# Altium project EFR32xG27_BLE_AGR_REF_DES_A00.PrjPCB
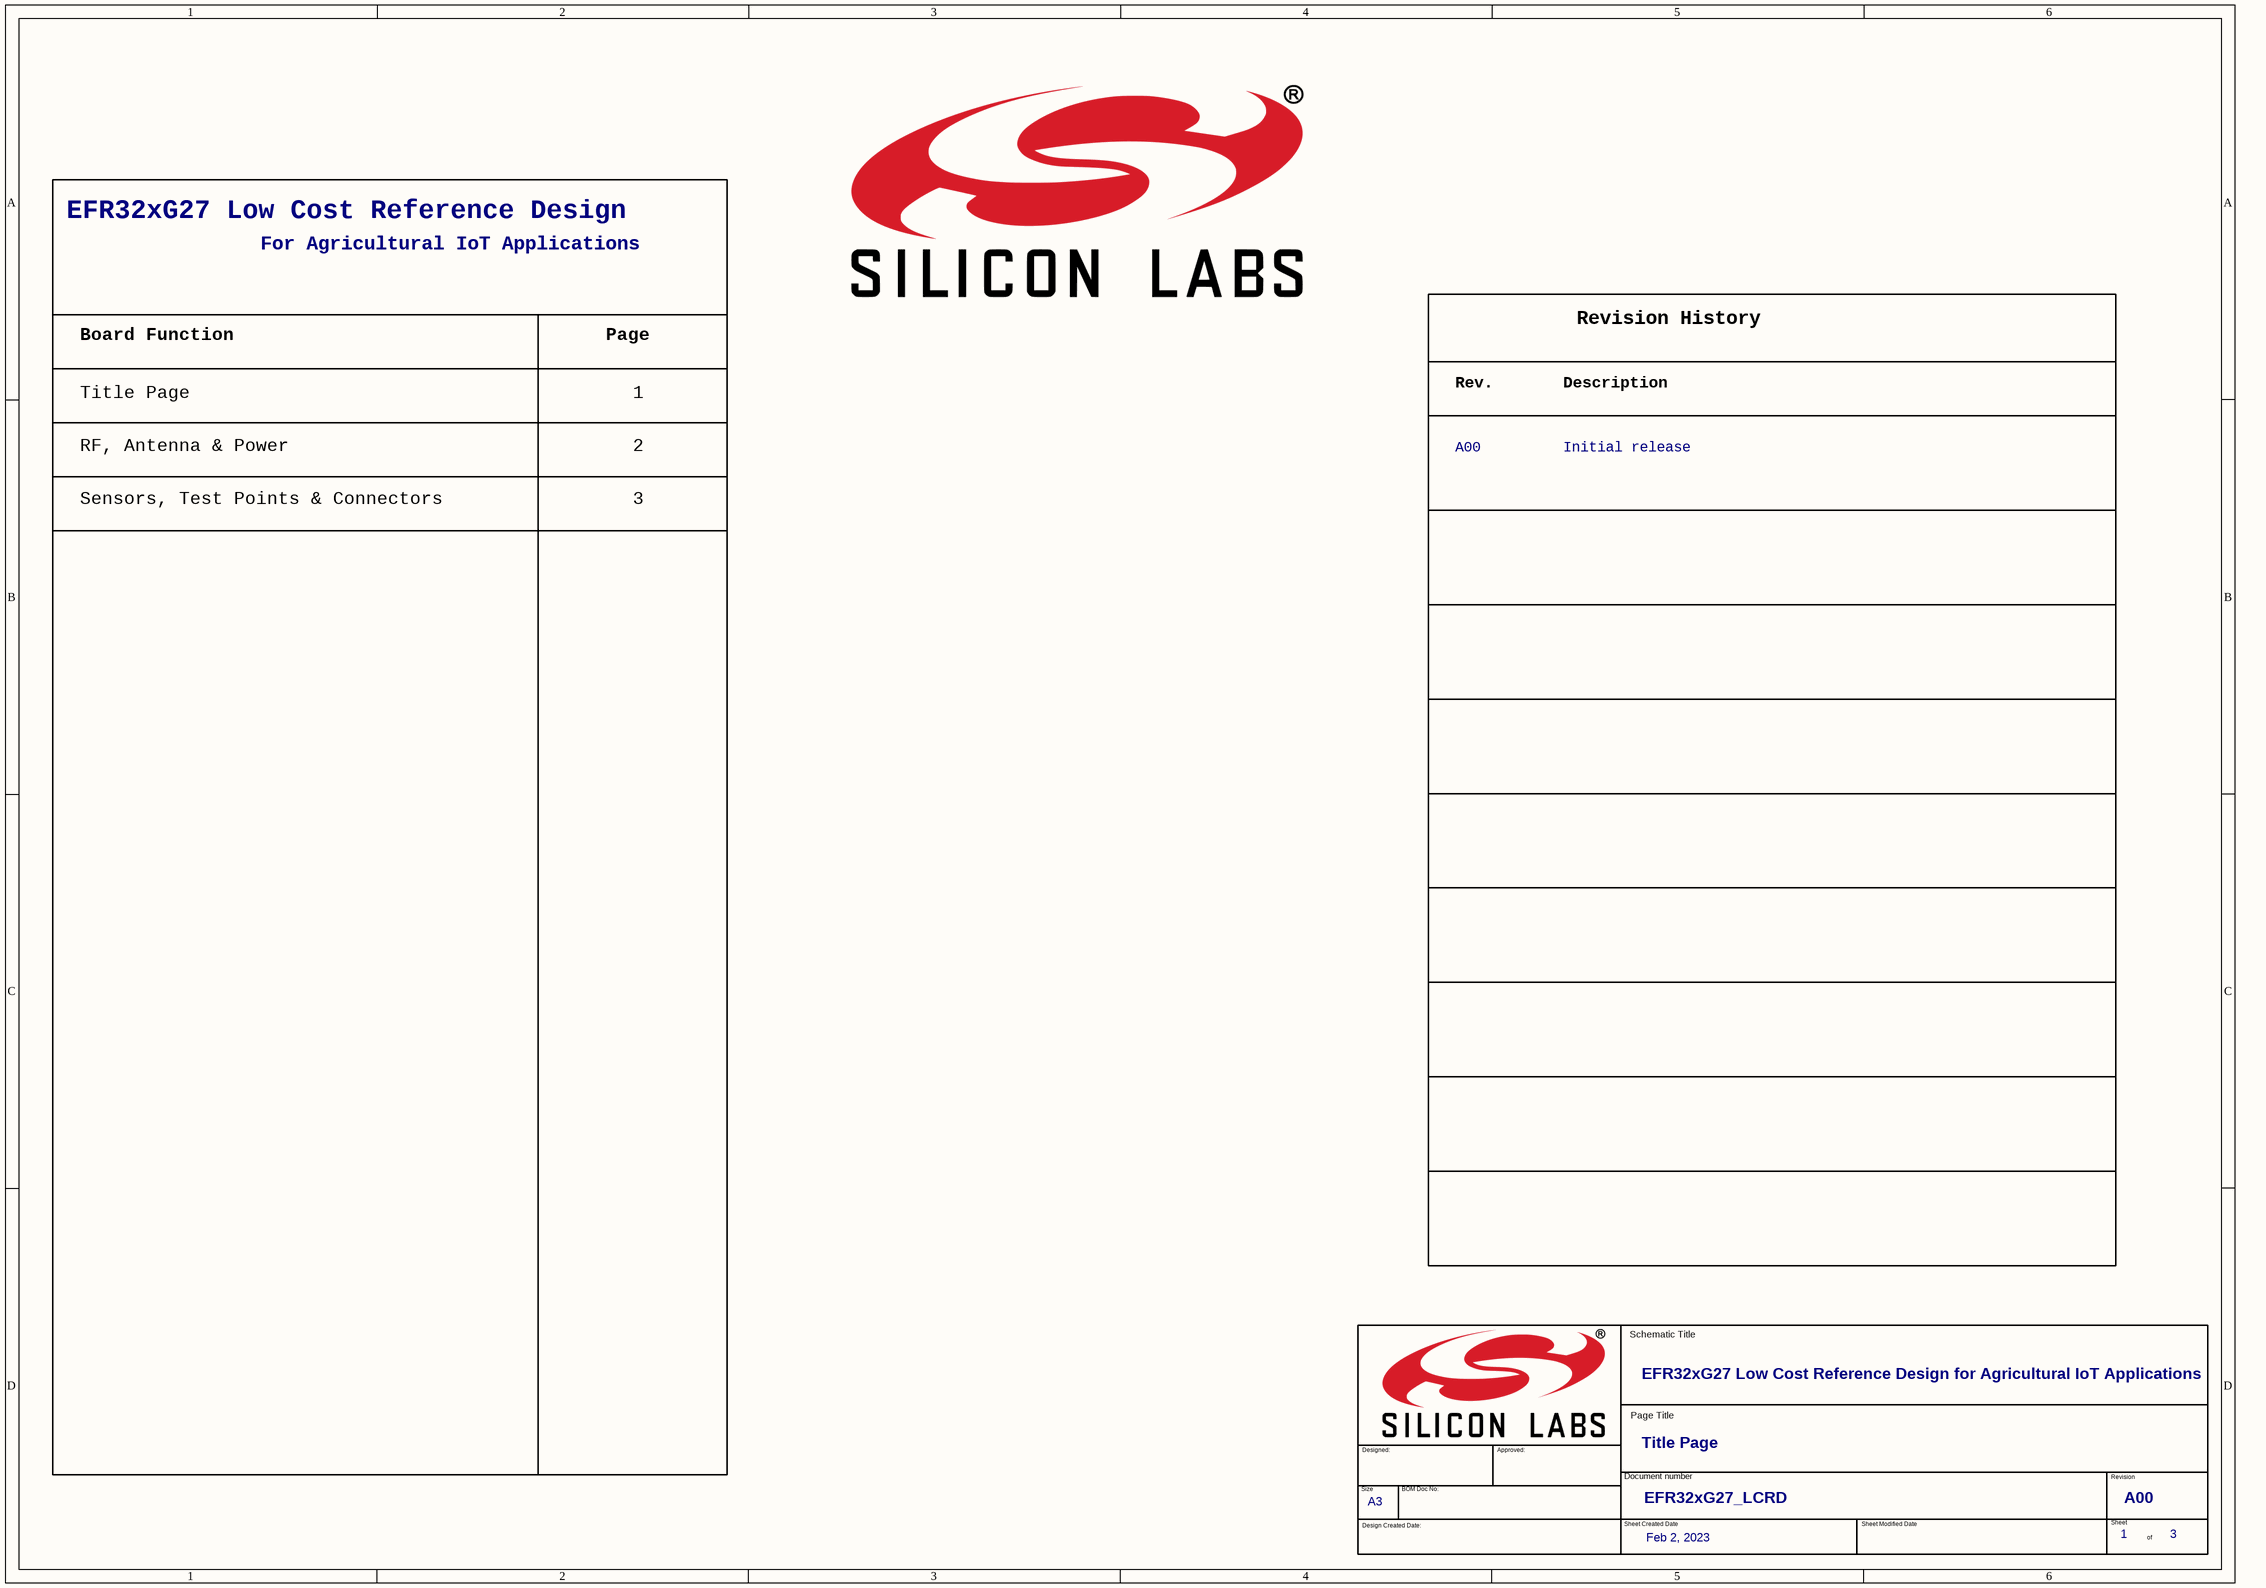
[diagram p0: EFR32xG27_BLE_AGR_REF_DES_A00_Cover.SchDoc]
AssemblyPrintName: EFR32xG22_LC_REF_DES_A02_ASM; Board_No: EFR32xG22_LCRD; Board_Rev: A02; CamPrintName: EFR32xG22_LC_REF_DES_A01_CAM; ClassName: PCB Only; Company_Address_1: 343 Congress St; Company_Address_2: 4th Floor; Company_Address_3: Boston, MA 02210; Company_Design_Group: IoT Wireless Hardware Applications; Company_Tel: 617-951-0200; Company_Web_Site: www.silabs.com; FabPrintName: EFR32xG22_LC_REF_DES_A01_FAB; PCBLayoutName: EFR32xG22_LC_REF_DES_A01; SchematicName: EFR32xG22_LC_REF_DES_A02_SCH; Title: EFR32xG22 Low Cost Reference Design; VariantName: EFR32xG22_LC_REF_DES_A01; XYReportName: EFR32xG22_LC_REF_DES_A02_XYR
3 sheets, 119 parts. Net scope: global (net labels, ports and power ports of the same name join across sheets).
Board file: EFR32xG27_BLE_AGR_REF_DES_A00.PcbDoc
Sheets:
  EFR32xG27_BLE_AGR_REF_DES_A00_Cover.SchDoc
  EFR32xG27_BLE_AGR_REF_DES_A00_Sheet1.SchDoc
  EFR32xG27_BLE_AGR_REF_DES_A00_Sheet2.SchDoc

## Sheet EFR32xG27_BLE_AGR_REF_DES_A00_Cover.SchDoc: EFR32xG22 Low Cost Reference Design
size 420 x 297 mm

### Parts
(Parts that share a designator on the sheet are numbered #1, #2 ... from top to bottom, then left to right.)
*?#1  Header A: EFR32xG27 Low Cost Reference Design  (hidden comment: Toc_Header)  (graphical)
*?#2  Rev1: A00  (hidden comment: Rev_History)  (graphical)
*?#3  Page Title: Title Page  Page Size: A3  Title: EFR32xG27 Low Cost Reference Design for Agricultural IoT Applications  Page Number: 1  Page Count: 3  (hidden comment: TitleBlock_EnergyMicro_A3)  (graphical)

### Notes on the sheet
- For Agricultural IoT Applications
- Board Function
- Page
- RF, Antenna & Power
- Title Page
- 1
- 2
- Initial release
- Sensors, Test Points & Connectors
- 3
- EFR32xG27_LCRD
- Feb 2, 2023
- A00
- (in symbol Rev_History) Revision History; Rev.; Description
- (in symbol TitleBlock_EnergyMicro_A3) Schematic Title; Page Title; Designed:; Approved:; Document number; Revision; Size; BOM Doc No:; Design Created Date:; Sheet Created Date; Sheet Modified Date; Sheet; of

### Library data of the parts
*?#1 = Toc_Header: Title: EFR32xG21 2.4 GHz 20 dBm Radio Board; RevCode: A00; OrgName: Silicon Labs; Page Number: 1; Page Count: 4; Doc: BRD4180A
*?#2 = Rev_History: Initial release; Doc: BRD4180A; Title: EFR32xG21 2.4 GHz 20 dBm Radio Board; OrgAddr2: JNO; OrgAddr1: JSH; OrgName: Silicon Labs; Page Number: 1; Page Count: 5; RevCode: A00
*?#3 = TitleBlock_EnergyMicro_A3: OrgName: Silicon Labs

## Sheet EFR32xG27_BLE_AGR_REF_DES_A00_Sheet1.SchDoc: EFR32xG22 Low Cost Reference Design
size 420 x 297 mm
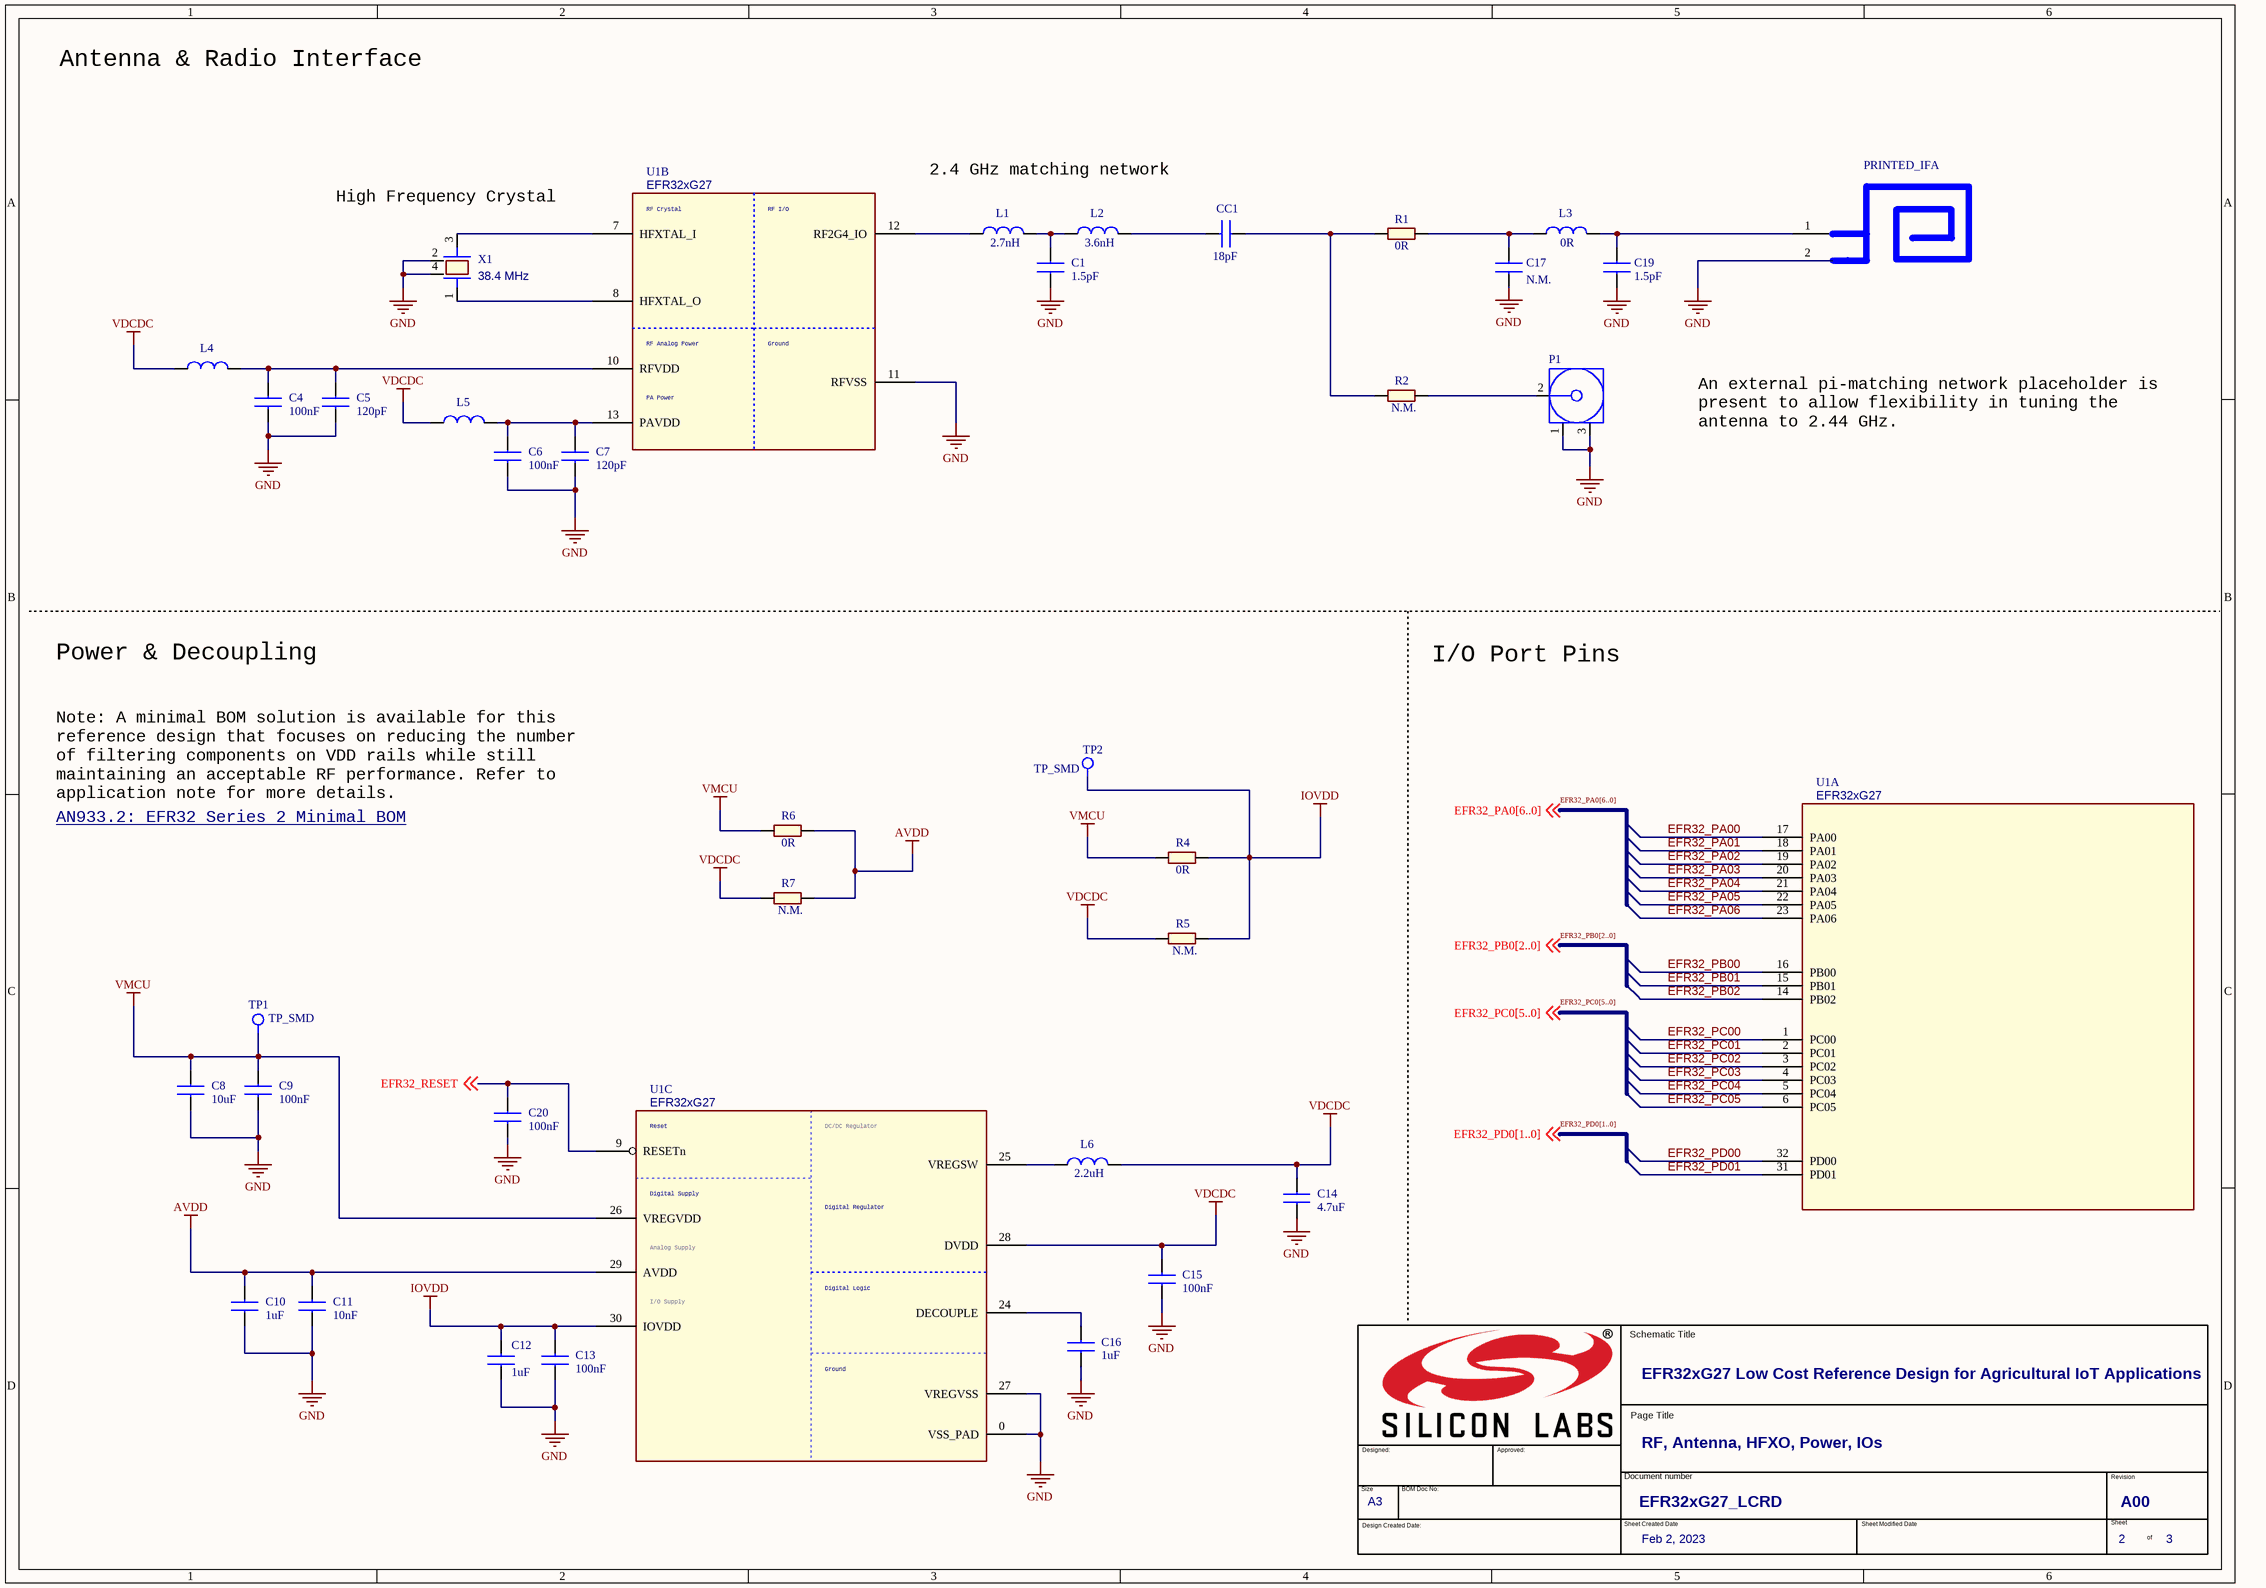
[diagram p1: EFR32xG27_BLE_AGR_REF_DES_A00_Sheet1.SchDoc]

### Parts
(Parts that share a designator on the sheet are numbered #1, #2 ... from top to bottom, then left to right.)
*?#4  Page Title: RF, Antenna, HFXO, Power, IOs  Page Size: A3  Title: EFR32xG27 Low Cost Reference Design for Agricultural IoT Applications  Page Number: 2  Page Count: 3  (hidden comment: TitleBlock_EnergyMicro_A3)  (graphical)
AT1  PRINTED_IFA  [SPIRAL_IFA_INV]
C1  value 1.5pF  [0201]
C4  value 100nF  [0201]
C5  value 120pF  [0201]
C6  value 100nF  [0201]
C7  value 120pF  [0201]
C8  value 10uF  [C_0402]
C9  value 100nF  [0201]
C10  value 1uF  [C_0402]
C11  value 10nF  [0201]
C12  value 1uF  [C_0402]
C13  value 100nF  [0201]
C14  value 4.7uF  [C_0402]
C15  value 100nF  [0201]
C16  value 1uF  [C_0402]
C17  Not Mounted: N.M.  [0201]
C19  value 1.5pF  [0201]
C20  value 100nF  [0201]
CC1  value 18pF  [0201]
L1  value 2.7nH  [0201]
L2  value 3.6nH  [0201]
L3  value 0R  [0201]
L4  (no value)  [L_0603]
L5  (no value)  [L_0603]
L6  value 2.2uH  [L_0603]
P1  1909763-1  [TECO-1909763-1_V]  (value not drawn)
R1  value 0R  [0201]
R2  Not Mounted: N.M.  [0201]
R4  value 0R  [0201]
R5  Not Mounted: N.M.  [0201]
R6  value 0R  [0201]
R7  Not Mounted: N.M.  [0201]
TP1  TP_SMD  [TP]
TP2  TP_SMD  [TP]
U1  EFR32xG27  [EFR_QFN32]  (parts A,B,C of 3)
X1  38.4 MHz  [HFXO_TZ2205E]

### Nets
AVDD: C10.1 C11.1 R6.2 R7.2 U1.29(AVDD)
GND: AT1.2(GND) C1.2 C4.2 C5.2 C6.2 C7.2 C8.2 C9.2 C10.2 C11.2 C12.2 C13.2 C14.2 C15.2 C16.2 C17.2 C19.2 C20.2 P1.1 P1.3 U1.0(VSS_PAD) U1.11(RFVSS) U1.27(VREGVSS) X1.2 X1.4
IOVDD: C12.1 C13.1 R4.2 R5.2 TP2.1(TP) U1.30(IOVDD)
VDCDC: C14.1 C15.1 L4.1 L5.1 L6.2 R5.1 R7.1 U1.28(DVDD)
VMCU: C8.1 C9.1 R4.1 R6.1 TP1.1(TP) U1.26(VREGVDD)
EFR32_PA00: U1.17(PA00)
EFR32_PA01: U1.18(PA01)
EFR32_PA02: U1.19(PA02)
EFR32_PA03: U1.20(PA03)
EFR32_PA04: U1.21(PA04)
EFR32_PA05: U1.22(PA05)
EFR32_PA06: U1.23(PA06)
EFR32_PB00: U1.16(PB00)
EFR32_PB01: U1.15(PB01)
EFR32_PB02: U1.14(PB02)
EFR32_PC00: U1.1(PC00)
EFR32_PC01: U1.2(PC01)
EFR32_PC02: U1.3(PC02)
EFR32_PC03: U1.4(PC03)
EFR32_PC04: U1.5(PC04)
EFR32_PC05: U1.6(PC05)
EFR32_PD00: U1.32(PD00)
EFR32_PD01: U1.31(PD01)
EFR32_RESET: C20.1 U1.9(RESETn) ; off-sheet EFR32_RESET
NetC1_1: C1.1 L1.2 L2.1
NetC4_1: C4.1 C5.1 L4.2 U1.10(RFVDD)
NetC6_1: C6.1 C7.1 L5.2 U1.13(PAVDD)
NetC16_1: C16.1 U1.24(DECOUPLE)
NetC17_1: C17.1 L3.1 R1.2
NetC19_1: C19.1 L3.2
NetCC1_1: CC1.1 L2.2
NetCC1_2: CC1.2 R1.1 R2.1
NetL1_1: L1.1 U1.12(RF2G4_IO)
NetL6_1: L6.1 U1.25(VREGSW)
NetP1_2: P1.2 R2.2
NetU1_7: U1.7(HFXTAL_I) X1.3
NetU1_8: U1.8(HFXTAL_O) X1.1

Not connected (* = marked no-connect by the designer): AT1 1(RF)

### Buses and harness runs
bus EFR32_PA0[6..0]
bus EFR32_PB0[2..0]
bus EFR32_PC0[5..0]
bus EFR32_PD0[1..0]

### Notes on the sheet
- Antenna & Radio Interface
- 2.4 GHz matching network
- (near X1) High Frequency Crystal
- An external pi-matching network placeholder is present to allow flexibility in tuning the antenna to 2.44 GHz.
- Power & Decoupling
- I/O Port Pins
- Note: A minimal BOM solution is available for this reference design that focuses on reducing the number of filtering components on VDD rails while still maintaining an acceptable RF performance. Refer to application note for more details.
- AN933.2: EFR32 Series 2 Minimal BOM
- Feb 2, 2023
- EFR32xG27_LCRD
- A00
- Labels drawn without touching a wire or pin: EFR32_PA0[6..0], EFR32_PB0[2..0], EFR32_PC0[5..0], EFR32_PD0[1..0]
- (in symbol EFR32xG22-2.4GHZ-QFN32, part B) RF Crystal; RF I/O; RF Analog Power; Ground; PA Power
- (in symbol EFR32xG22-2.4GHZ-QFN32, part C) Reset; DC/DC Regulator; Digital Supply; Digital Regulator; Analog Supply; Digital Logic; I/O Supply; Ground
- (in symbol TitleBlock_EnergyMicro_A3) Schematic Title; Page Title; Designed:; Approved:; Document number; Revision; Size; BOM Doc No:; Design Created Date:; Sheet Created Date; Sheet Modified Date; Sheet; of

### Library data of the parts
*?#4 = TitleBlock_EnergyMicro_A3: OrgName: Silicon Labs
AT1 = SPIRAL_IFA
C1 C19 = C0201: Ceramic capacitor; Manufacturer: Murata; Part Number: GRM0335C1H1R5BA01; Rating: 50V; Tolerance: 0.1pF; Technology: C0G; Package: SMD0201
C4 C6 C9 C13 C15 C20 = C0201: Ceramic capacitor; Manufacturer: Murata; Part Number: GRM033R61E104ME14; Rating: 25V; Tolerance: 20%; Technology: X5R; Package: SMD0201
C5 C7 = C0201: Ceramic capacitor; Manufacturer: Murata; Part Number: GRM0335C1H121JA01; Rating: 50V; Tolerance: 5%; Technology: C0G; Package: SMD0201
C8 = C0201: Ceramic capacitor; Manufacturer: Murata; Part Number: GRM155R61C105MA12; Rating: 6.3V; Tolerance: 20%; Technology: X5R; Package: SMD0402
C10 C12 C16 = C0201: Ceramic capacitor; Manufacturer: Murata; Part Number: GRM155R61C105MA12; Rating: 16V; Tolerance: 20%; Technology: X5R; Package: SMD0402
C11 = C0201: Ceramic capacitor; Manufacturer: Murata; Part Number: GRM033R61A103MA01; Rating: 10V; Tolerance: 20%; Technology: X5R; Package: SMD0201
C14 = C0201: Ceramic capacitor; Manufacturer: Murata; Part Number: GRM155R61C105MA12; Rating: 10V; Tolerance: 20%; Technology: X6T; Package: SMD0402
C17 = C0201: Ceramic capacitor; Manufacturer: Murata; Part Number: GRM0335C1H1R6BA01; Rating: 50V; Tolerance: 0.1pF; Technology: C0G; Package: SMD0201
CC1 = C0201: Ceramic capacitor; Manufacturer: Murata; Part Number: GRM0335C1H180JA01; Rating: 50V; Tolerance: 5%; Technology: C0G; Package: SMD0201
L1 = L0201: Chip Inductor; Part Number: LQP03TN2N7B02; Manufacturer: Murata; Tolerance: 0.1nH; Rating: 500mA; Package: SMD0201
L2 = L0201: Chip Inductor; Part Number: LQP03TN3N6B02; Manufacturer: Murata; Tolerance: 0.1nH; Rating: 400mA; Package: SMD0201
L3 = L0201: Chip Inductor; Part Number: LQP03TN5N1H02; Manufacturer: Murata; Tolerance: 3%; Rating: 350mA; Package: SMD0201
L4 L5 = L0201: Ferrite Bead; Part Number: BLM18AG102SN1; Manufacturer: Murata; Value: 1000R; Rating: 450mA; DCR: 0.5R; Package: SMD0603
L6 = L0201: Ferrite Bead; Part Number: LQM18PZ2R2MFH; Manufacturer: Murata; Tolerance: 20%; Rating: 300mA; Package: SMD0603
P1 = CN-1P-M-RF3: SMT Ultra Miniature Coaxial Connector 50-ohm Jack, Female; Manufacturer: TE Connectivity; Package: TECO-1909763-1, 2.6 x 2.6 mm
R1 R4 R6 = R0201: zero ohm resistor; Manufacturer: Any
R2 R5 R7 = R0201: zero ohm resistor; Manufacturer: Any; Value: 0R
U1 = EFR32xG22-2.4GHZ-QFN32: 32-pin Wireless MCU, EFR32xG27 with buck converter; Manufacturer: Silicon Labs; Package: QFN32
X1 = HFXO: 38.4 MHz high frequency crystal; Part Number: TZ3398B; Manufacturer: Tai-Saw Technology; Tolerance: 20ppm; Load capacitance: 10pF

## Sheet EFR32xG27_BLE_AGR_REF_DES_A00_Sheet2.SchDoc: EFR32xG22 Low Cost Reference Design
size 420 x 297 mm
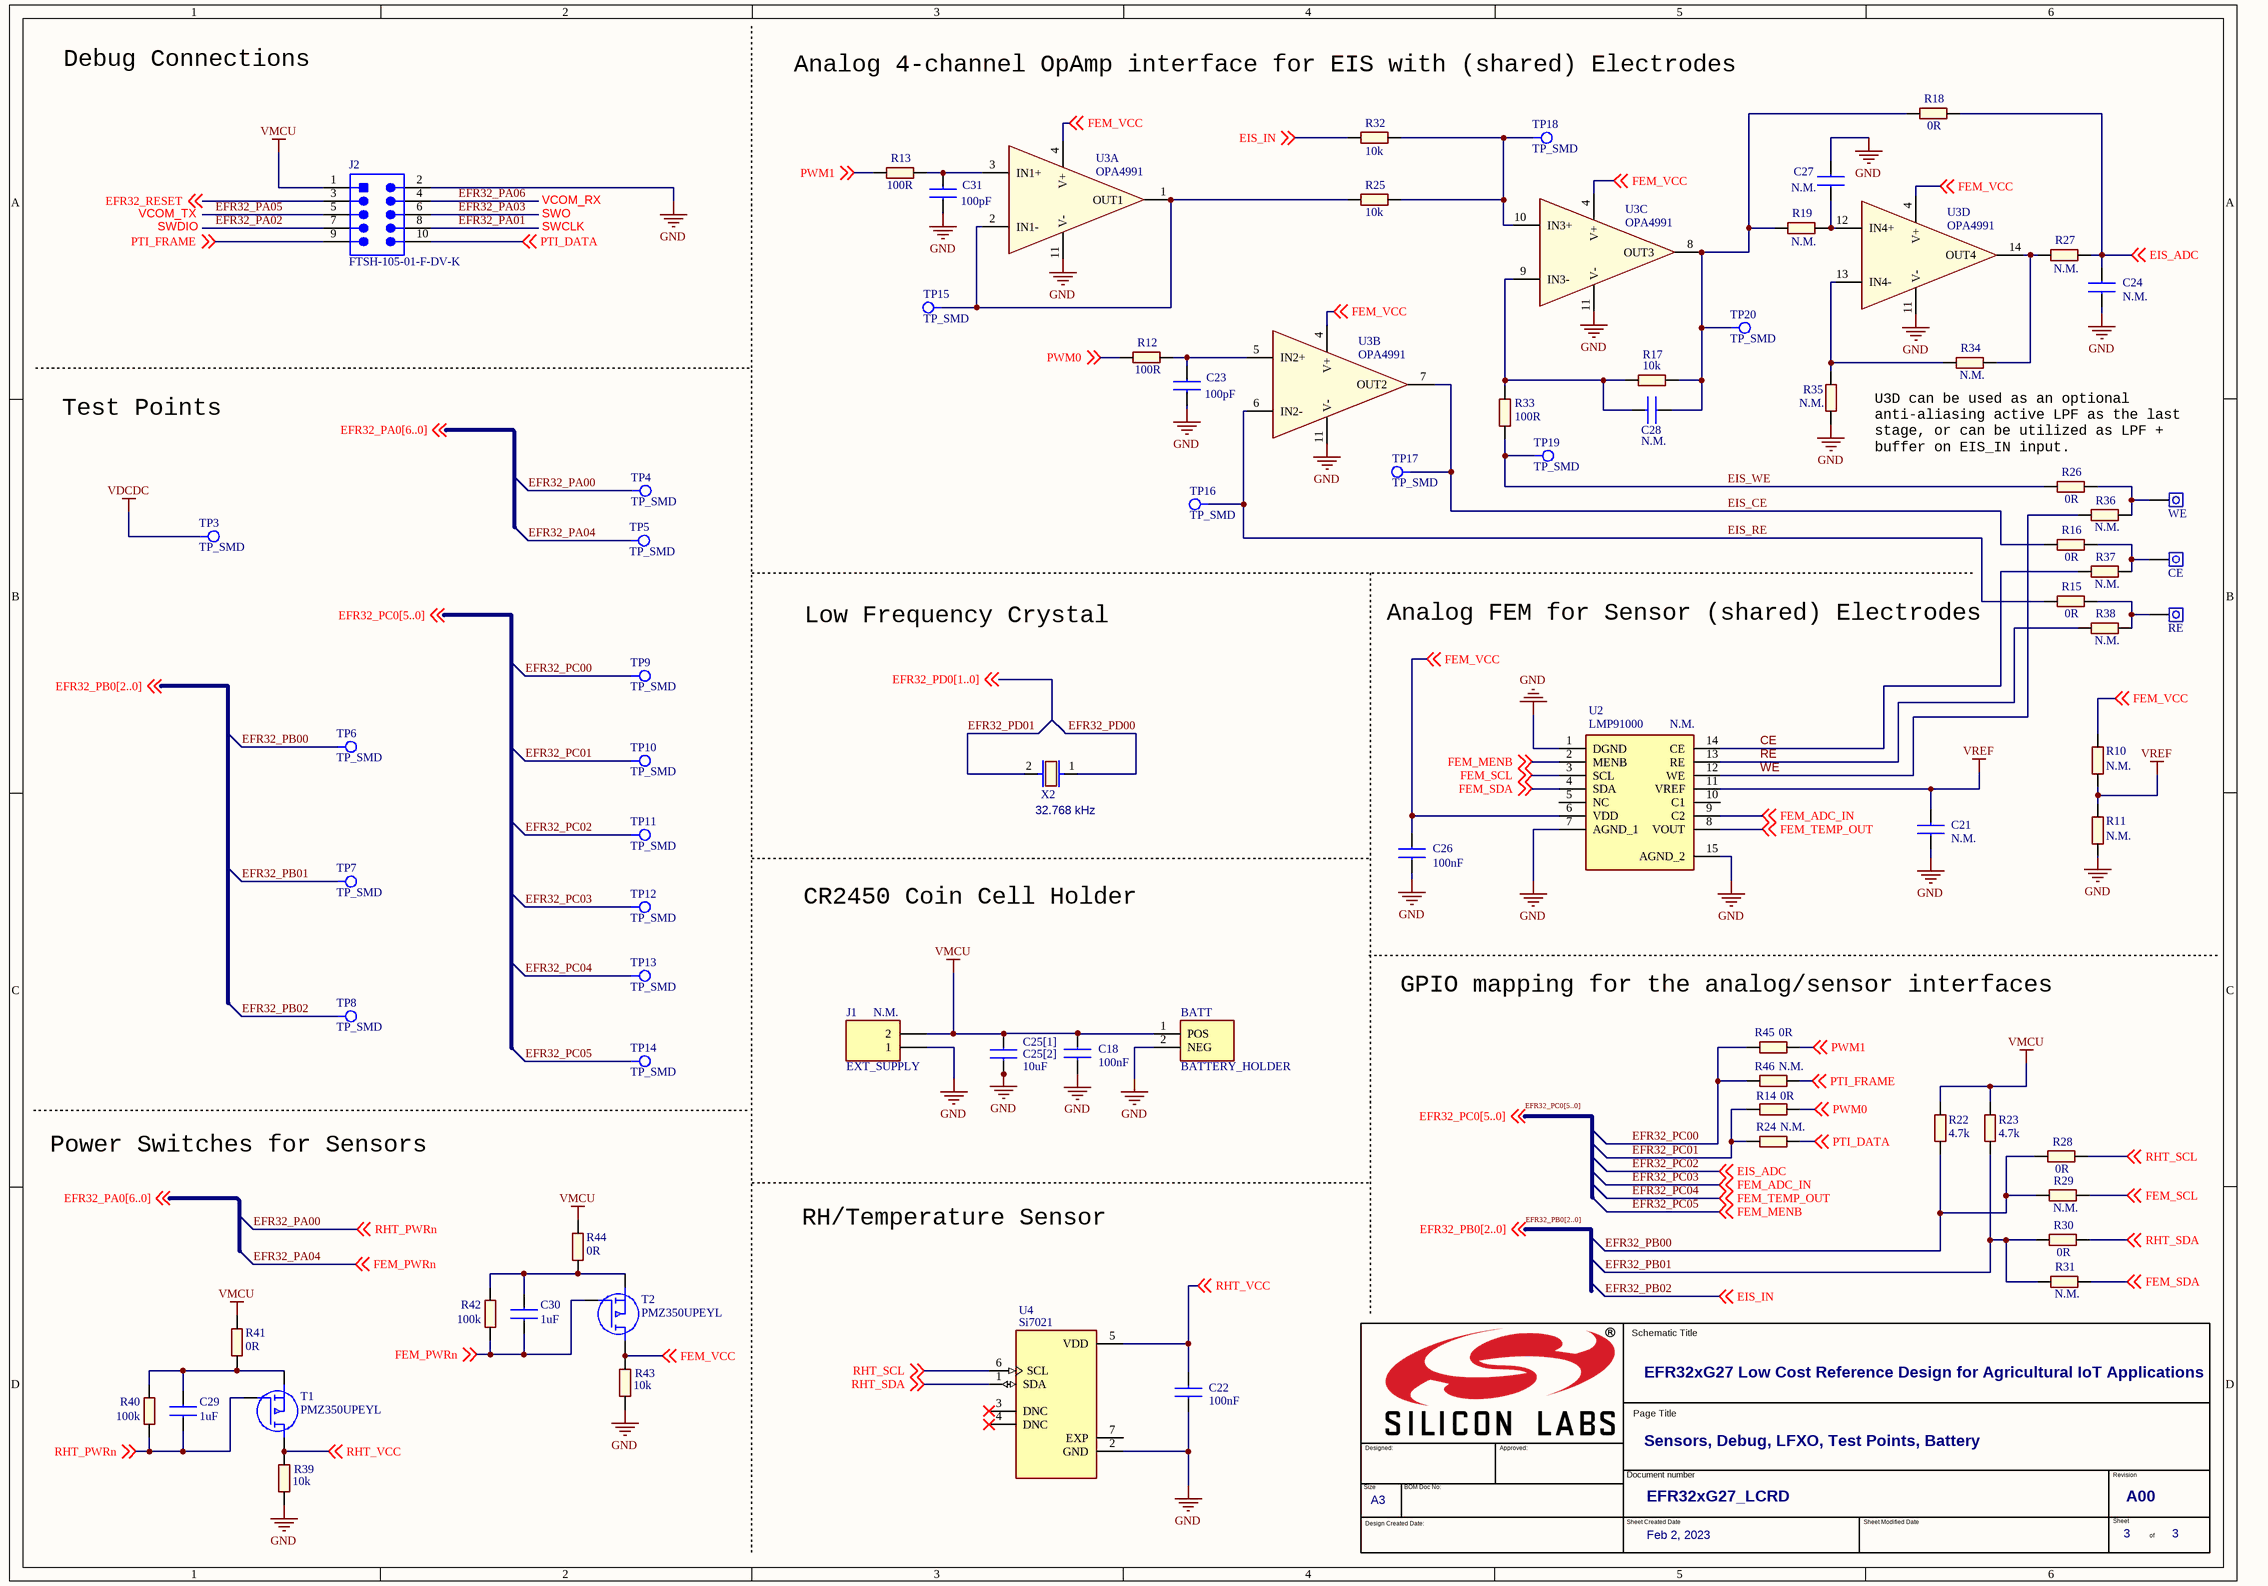
[diagram p2: EFR32xG27_BLE_AGR_REF_DES_A00_Sheet2.SchDoc]

### Parts
(Parts that share a designator on the sheet are numbered #1, #2 ... from top to bottom, then left to right.)
*?#5  Page Title: Sensors, Debug, LFXO, Test Points, Battery  Page Size: A3  Title: EFR32xG27 Low Cost Reference Design for Agricultural IoT Applications  Page Number: 3  (hidden comment: TitleBlock_EnergyMicro_A3)  (graphical)
BATT  BATTERY_HOLDER  [Battery_holder_CR2450_SMT_1052]
C18  value 100nF  [0201]
C21  Not Mounted: N.M.  [0201]
C22  value 100nF  [0201]
C23  value 100pF  [0201]
C24  Not Mounted: N.M.  [0201]
C25[1]  value 10uF  [C_0402]
C25[2]  (no value)  [C_0603]
C26  value 100nF  [0201]
C27  Not Mounted: N.M.  [0201]
C28  Not Mounted: N.M.  [0201]
C29  value 1uF  [C_0402]
C30  value 1uF  [C_0402]
C31  value 100pF  [0201]
CE  Sensor Electrode  [Sensor Electrode]  (value not drawn)
J1  EXT_SUPPLY  Not Mounted: N.M.  [Jumper_HDR_2.54mm]
J2  FTSH-105-01-F-DV-K  [SMTC-FTSH-105-01-L-DV-K_V]
R10  Not Mounted: N.M.  [0201]
R11  Not Mounted: N.M.  [0201]
R12  value 100R  [0201]
R13  value 100R  [0201]
R14  value 0R  [0201]
R15  value 0R  [0201]
R16  value 0R  [0201]
R17  value 10k  [0201]
R18  value 0R  [0201]
R19  Not Mounted: N.M.  [0201]
R22  value 4.7k  [0201]
R23  value 4.7k  [0201]
R24  Not Mounted: N.M.  [0201]
R25  value 10k  [0201]
R26  value 0R  [0201]
R27  Not Mounted: N.M.  [0201]
R28  value 0R  [0201]
R29  Not Mounted: N.M.  [0201]
R30  value 0R  [0201]
R31  Not Mounted: N.M.  [0201]
R32  value 10k  [0201]
R33  value 100R  [0201]
R34  Not Mounted: N.M.  [0201]
R35  Not Mounted: N.M.  [0201]
R36  Not Mounted: N.M.  [0201]
R37  Not Mounted: N.M.  [0201]
R38  Not Mounted: N.M.  [0201]
R39  value 10k  [0201]
R40  value 100k  [0201]
R41  value 0R  [0201]
R42  value 100k  [0201]
R43  value 10k  [0201]
R44  value 0R  [0201]
R45  value 0R  [0201]
R46  Not Mounted: N.M.  [0201]
RE  Sensor Electrode  [Sensor Electrode]  (value not drawn)
T1  PMZ350UPEYL  [SOT883_B_FIXED]
T2  PMZ350UPEYL  [SOT883_B_FIXED]
TP3  TP_SMD  [TP]
TP4  TP_SMD  [TP]
TP5  TP_SMD  [TP]
TP6  TP_SMD  [TP]
TP7  TP_SMD  [TP]
TP8  TP_SMD  [TP]
TP9  TP_SMD  [TP]
TP10  TP_SMD  [TP]
TP11  TP_SMD  [TP]
TP12  TP_SMD  [TP]
TP13  TP_SMD  [TP]
TP14  TP_SMD  [TP]
TP15  TP_SMD  [TP]
TP16  TP_SMD  [TP]
TP17  TP_SMD  [TP]
TP18  TP_SMD  [TP]
TP19  TP_SMD  [TP]
TP20  TP_SMD  [TP]
U2  LMP91000  Not Mounted: N.M.  [SON50P400X400X80-15N]
U3  OPA4991  [SOP65P640X120-14N]  (parts A,B,C,D of 4)
U4  Si7021  [SON100P300X300X121-7N]
WE  Sensor Electrode  [Sensor Electrode]  (value not drawn)
X2  32.768 kHz  [LFXO]

### Nets
GND: BATT.2(NEG) C18.2 C21.2 C22.2 C23.2 C24.2 C25[1].2 C25[2].2 C26.2 C27.1 C31.2 J1.1 J2.2 R11.1 R35.1 R39.1 R43.1 U2.1(DGND) U2.7(AGND_1) U2.15(AGND_2) U3.11(V-) U4.2(GND)
VDCDC: TP3.1(TP)
VMCU: BATT.1(POS) C18.1 C25[1].1 C25[2].1 J1.2 J2.1 R22.2 R23.2 R41.2 R44.2
VREF: C21.1 R10.1 R11.2 U2.11(VREF)
CE: R37.1 U2.14(CE)
EFR32_PA00: C29.2 R40.1 T1.G TP4.1(TP) ; off-sheet RHT_PWRn  [also labelled RHT_PWRn]
EFR32_PA01: J2.8
EFR32_PA02: J2.7
EFR32_PA03: J2.6
EFR32_PA04: C30.2 R42.1 T2.G TP5.1(TP) ; off-sheet FEM_PWRn  [also labelled FEM_PWRn]
EFR32_PA05: J2.5
EFR32_PA06: J2.4
EFR32_PB00: R22.1 R28.1 R29.1 TP6.1(TP)
EFR32_PB01: R23.1 R30.1 R31.1 TP7.1(TP)
EFR32_PB02: R32.1 TP8.1(TP) ; off-sheet EIS_IN  [also labelled EIS_IN]
EFR32_PC00: R45.1 R46.1 TP9.1(TP)
EFR32_PC01: R14.1 R24.1 TP10.1(TP)
EFR32_PC02: C24.1 R18.2 R27.2 TP11.1(TP) ; off-sheet EIS_ADC  [also labelled EIS_ADC]
EFR32_PC03: TP12.1(TP) U2.9(C2) ; off-sheet FEM_ADC_IN  [also labelled FEM_ADC_IN]
EFR32_PC04: TP13.1(TP) U2.8(VOUT) ; off-sheet FEM_TEMP_OUT  [also labelled FEM_TEMP_OUT]
EFR32_PC05: TP14.1(TP) U2.2(MENB) ; off-sheet FEM_MENB  [also labelled FEM_MENB]
EFR32_PD00: X2.1
EFR32_PD01: X2.2
EFR32_RESET: J2.3 ; off-sheet EFR32_RESET
EIS_CE: R16.1 TP17.1(TP) U3.7(OUT2)
EIS_RE: R15.1 TP16.1(TP) U3.6(IN2-)
EIS_WE: R26.1 R33.1 TP19.1(TP)
FEM_SCL: R29.2 U2.3(SCL) ; off-sheet FEM_SCL
FEM_SDA: R31.2 U2.4(SDA) ; off-sheet FEM_SDA
FEM_VCC: C26.1 R10.2 R43.2 T2.D U2.6(VDD) U3.4(V+) ; off-sheet FEM_VCC
PTI_DATA: J2.10 R24.2 ; off-sheet PTI_DATA
PTI_FRAME: J2.9 R46.2 ; off-sheet PTI_FRAME
PWM0: R12.1 R14.2 ; off-sheet PWM0
PWM1: R13.1 R45.2 ; off-sheet PWM1
RE: R38.1 U2.13(RE)
RHT_SCL: R28.2 U4.6(SCL) ; off-sheet RHT_SCL
RHT_SDA: R30.2 U4.1(SDA) ; off-sheet RHT_SDA
RHT_VCC: C22.1 R39.2 T1.D U4.5(VDD) ; off-sheet RHT_VCC
WE: R36.1 U2.12(WE)
NetC23_1: C23.1 R12.2 U3.5(IN2+)
NetC27_2: C27.2 R19.2 U3.12(IN4+)
NetC28_1: C28.1 R17.1 R33.2 U3.9(IN3-)
NetC28_2: C28.2 R17.2 R18.1 R19.1 TP20.1(TP) U3.8(OUT3)
NetC29_1: C29.1 R40.2 R41.1 T1.S
NetC30_1: C30.1 R42.2 R44.1 T2.S
NetC31_1: C31.1 R13.2 U3.3(IN1+)
NetCE_1: CE.1 R16.2 R37.2
NetR15_2: R15.2 R38.2 RE.1
NetR25_1: R25.1 TP15.1(TP) U3.1(OUT1) U3.2(IN1-)
NetR25_2: R25.2 R32.2 TP18.1(TP) U3.10(IN3+)
NetR26_2: R26.2 R36.2 WE.1
NetR27_1: R27.1 R34.2 U3.14(OUT4)
NetR34_1: R34.1 R35.2 U3.13(IN4-)

Not connected (* = marked no-connect by the designer): U2 5(NC) 10(C1); U4 3(DNC)* 4(DNC)* 7(EXP)

### Buses and harness runs
bus EFR32_PB0[2..0]
bus EFR32_PC0[5..0]

### Notes on the sheet
- Debug Connections
- Analog 4-channel OpAmp interface for EIS with (shared) Electrodes
- VCOM_TX
- SWDIO
- VCOM_RX
- SWO
- SWCLK
- Test Points
- U3D can be used as an optional anti-aliasing active LPF as the last stage, or can be utilized as LPF + buffer on EIS_IN input.
- Low Frequency Crystal
- Analog FEM for Sensor (shared) Electrodes
- CR2450 Coin Cell Holder
- (near R45) GPIO mapping for the analog/sensor interfaces
- Power Switches for Sensors
- RH/Temperature Sensor
- Feb 2, 2023
- EFR32xG27_LCRD
- A00
- Labels drawn without touching a wire or pin: EFR32_PB0[2..0], EFR32_PC0[5..0]
- (in symbol TitleBlock_EnergyMicro_A3) Schematic Title; Page Title; Designed:; Approved:; Document number; Revision; Size; BOM Doc No:; Design Created Date:; Sheet Created Date; Sheet Modified Date; Sheet; of

### Library data of the parts
*?#5 = TitleBlock_EnergyMicro_A3: OrgName: Silicon Labs; Page Count: 3
BATT = 1052TR: 2450 SMT battery holder 1052; Manufacturer: Keystone Electronics Corp.; Part Number: 1052TR
C18 C22 C26 = C0201: as C4 on sheet EFR32xG27_BLE_AGR_REF_DES_A00_Sheet1; Technology: X5R; Package: SMD0201
C21 = C0201: Ceramic capacitor; Manufacturer: Murata; Part Number: GRM033R61E104ME14; Rating: 25V; Tolerance: 20%; Value: 100nF; Technology: X5R; Package: SMD0201
C23 C31 = C0201: Ceramic capacitor; Manufacturer: Murata; Part Number: GRM033R61E101KA01; Rating: 25V; Tolerance: 10%; Technology: X5R; Package: SMD0201
C24 = C0201: Ceramic capacitor; Manufacturer: Murata; Rating: 25V; Tolerance: 20%; Technology: X5R; Package: SMD0201
C25[1] = C0201: as C8 on sheet EFR32xG27_BLE_AGR_REF_DES_A00_Sheet1; Technology: X5R; Package: SMD0402
C25[2] = C0201: Ceramic capacitor; Manufacturer: Murata; Part Number: GRM188R61A106MAAL; Rating: 10V; Tolerance: 20%; Not Mounted: N.M.; Value: 10uF; Technology: X5R; Package: SMD0603
C27 C28 = C0201: Ceramic capacitor; Manufacturer: Murata; Rating: 25V; Tolerance: 5%; Technology: C0G; Package: SMD0201
C29 C30 = C0201: as C10 on sheet EFR32xG27_BLE_AGR_REF_DES_A00_Sheet1; Technology: X5R; Package: SMD0402
CE RE WE = Sensor Electrode: Footprint for external sensor electrode
J1 = HTSW-102-28-F-S: CONN HEADER VERT 2POS 2.54MM; Part Number: 75160-101-02LF; Manufacturer: Amphenol ICC (FCI)
J2 = CMP-2000-05352-1: 10-pin mini-simplicity header; Manufacturer: Samtec; Part Number: FTSH-105-01-L-DV-K; Package: Male Header, Pitch 1.27 mm, 2 x 5 Position
R10 R11 R24 R29 R31 R36-R38 R46 = R0201: as R2 on sheet EFR32xG27_BLE_AGR_REF_DES_A00_Sheet1
R12-R19 R22 R23 R25-R28 R30 R32-R35 R39-R45 = R0201: zero ohm resistor; Manufacturer: Any
T1 T2 = PMZ350UPEYL: P-Channel Trench MOSFET 20V 1A (Ta) 360mW (Ta), 3.125W (Tc) Surface Mount DFN1006-3; Manufacturer: Nexperia; Rating: 30V; Package: SOT-883; Part Number: PMZ350UPEYL
U2 = LMP91000SDE: Analog AFE Integrated Circuit; Manufacturer: Texas Instruments; Part Number: LMP91000SDE; Package: 14-Pin WSON
U3 = OPA4991_4-ch: 4-channel OpAmp Integrated Circuit; Manufacturer: Texas Instruments; Part Number: OPA4991IPWR; Package: 14-pin TSSOP
U4 = SI7021-A10-GM: Board Mount Humidity and Temperature sensor; Manufacturer: Silicon Labs; Part Number: Si7021-A10-GM; Package: DFN-6 Silicon Labs
X2 = LFXO: 32.768 kHz low frequency crystal; Part Number: CM8V-T1A; Manufacturer: Micro Crystal AG; Tolerance: 20ppm; Load capacitance: 7pF

## Nets that join several sheets
GND: EFR32xG27_BLE_AGR_REF_DES_A00_Sheet1 (25 pins), EFR32xG27_BLE_AGR_REF_DES_A00_Sheet2 (22 pins)
VDCDC: EFR32xG27_BLE_AGR_REF_DES_A00_Sheet1 (8 pins), EFR32xG27_BLE_AGR_REF_DES_A00_Sheet2 (TP3.1)
VMCU: EFR32xG27_BLE_AGR_REF_DES_A00_Sheet1 (6 pins), EFR32xG27_BLE_AGR_REF_DES_A00_Sheet2 (10 pins)
EFR32_PA00: EFR32xG27_BLE_AGR_REF_DES_A00_Sheet1 (U1.17), EFR32xG27_BLE_AGR_REF_DES_A00_Sheet2 (C29.2 R40.1 T1.G TP4.1)
EFR32_PA01: EFR32xG27_BLE_AGR_REF_DES_A00_Sheet1 (U1.18), EFR32xG27_BLE_AGR_REF_DES_A00_Sheet2 (J2.8)
EFR32_PA02: EFR32xG27_BLE_AGR_REF_DES_A00_Sheet1 (U1.19), EFR32xG27_BLE_AGR_REF_DES_A00_Sheet2 (J2.7)
EFR32_PA03: EFR32xG27_BLE_AGR_REF_DES_A00_Sheet1 (U1.20), EFR32xG27_BLE_AGR_REF_DES_A00_Sheet2 (J2.6)
EFR32_PA04: EFR32xG27_BLE_AGR_REF_DES_A00_Sheet1 (U1.21), EFR32xG27_BLE_AGR_REF_DES_A00_Sheet2 (C30.2 R42.1 T2.G TP5.1)
EFR32_PA05: EFR32xG27_BLE_AGR_REF_DES_A00_Sheet1 (U1.22), EFR32xG27_BLE_AGR_REF_DES_A00_Sheet2 (J2.5)
EFR32_PA06: EFR32xG27_BLE_AGR_REF_DES_A00_Sheet1 (U1.23), EFR32xG27_BLE_AGR_REF_DES_A00_Sheet2 (J2.4)
EFR32_PB00: EFR32xG27_BLE_AGR_REF_DES_A00_Sheet1 (U1.16), EFR32xG27_BLE_AGR_REF_DES_A00_Sheet2 (R22.1 R28.1 R29.1 TP6.1)
EFR32_PB01: EFR32xG27_BLE_AGR_REF_DES_A00_Sheet1 (U1.15), EFR32xG27_BLE_AGR_REF_DES_A00_Sheet2 (R23.1 R30.1 R31.1 TP7.1)
EFR32_PB02: EFR32xG27_BLE_AGR_REF_DES_A00_Sheet1 (U1.14), EFR32xG27_BLE_AGR_REF_DES_A00_Sheet2 (R32.1 TP8.1)
EFR32_PC00: EFR32xG27_BLE_AGR_REF_DES_A00_Sheet1 (U1.1), EFR32xG27_BLE_AGR_REF_DES_A00_Sheet2 (R45.1 R46.1 TP9.1)
EFR32_PC01: EFR32xG27_BLE_AGR_REF_DES_A00_Sheet1 (U1.2), EFR32xG27_BLE_AGR_REF_DES_A00_Sheet2 (R14.1 R24.1 TP10.1)
EFR32_PC02: EFR32xG27_BLE_AGR_REF_DES_A00_Sheet1 (U1.3), EFR32xG27_BLE_AGR_REF_DES_A00_Sheet2 (C24.1 R18.2 R27.2 TP11.1)
EFR32_PC03: EFR32xG27_BLE_AGR_REF_DES_A00_Sheet1 (U1.4), EFR32xG27_BLE_AGR_REF_DES_A00_Sheet2 (TP12.1 U2.9)
EFR32_PC04: EFR32xG27_BLE_AGR_REF_DES_A00_Sheet1 (U1.5), EFR32xG27_BLE_AGR_REF_DES_A00_Sheet2 (TP13.1 U2.8)
EFR32_PC05: EFR32xG27_BLE_AGR_REF_DES_A00_Sheet1 (U1.6), EFR32xG27_BLE_AGR_REF_DES_A00_Sheet2 (TP14.1 U2.2)
EFR32_PD00: EFR32xG27_BLE_AGR_REF_DES_A00_Sheet1 (U1.32), EFR32xG27_BLE_AGR_REF_DES_A00_Sheet2 (X2.1)
EFR32_PD01: EFR32xG27_BLE_AGR_REF_DES_A00_Sheet1 (U1.31), EFR32xG27_BLE_AGR_REF_DES_A00_Sheet2 (X2.2)
EFR32_RESET: EFR32xG27_BLE_AGR_REF_DES_A00_Sheet1 (C20.1 U1.9), EFR32xG27_BLE_AGR_REF_DES_A00_Sheet2 (J2.3)